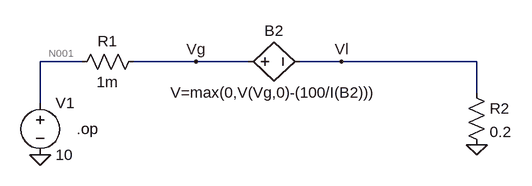
[diagram p0: schematic limiter1.asc]
limiter1.asc, the LTspice schematic file:
Version 4
SHEET 1 880 680
WIRE -144 96 -208 96
WIRE 32 96 -64 96
WIRE 112 96 32 96
WIRE 256 96 192 96
WIRE 464 96 256 96
WIRE 464 144 464 96
WIRE -208 160 -208 96
FLAG -208 240 0
FLAG 464 224 0
FLAG 256 96 Vl
FLAG 32 96 Vg
SYMBOL voltage -208 144 R0
WINDOW 123 0 0 Left 0
WINDOW 39 0 0 Left 0
SYMATTR InstName V1
SYMATTR Value 10
SYMBOL res -160 112 R270
WINDOW 0 32 56 VTop 2
WINDOW 3 0 56 VBottom 2
SYMATTR InstName R1
SYMATTR Value 1m
SYMBOL res 448 128 R0
SYMATTR InstName R2
SYMATTR Value 0.2
SYMBOL bv 96 96 R270
WINDOW 0 32 56 VTop 2
WINDOW 3 -32 56 VBottom 2
SYMATTR InstName B2
SYMATTR Value V=max(0,V(Vg,0)-(100/I(B2)))
TEXT -152 200 Left 2 !.op

The netlist it stands for:
* limiter1.asc
V1 N001 0 10
R1 N001 Vg 1m
R2 Vl 0 0.2
B2 Vg Vl V=max(0,V(Vg,0)-(100/I(B2)))
.op
.backanno
.end

* Results of the author's LTspice run, read from the files saved beside the schematic
* Operating Point:
*   V(n001) = 10 V
*   V(vg) = 9.978 V
*   V(vl) = 4.472 V
*   I(B2) = 22.36 A
*   I(R2) = 22.36 A
*   I(R1) = 22.36 A
*   I(V1) = -22.36 A